# Altium schematic sheet MR9737V2.0.SchDoc
size A3
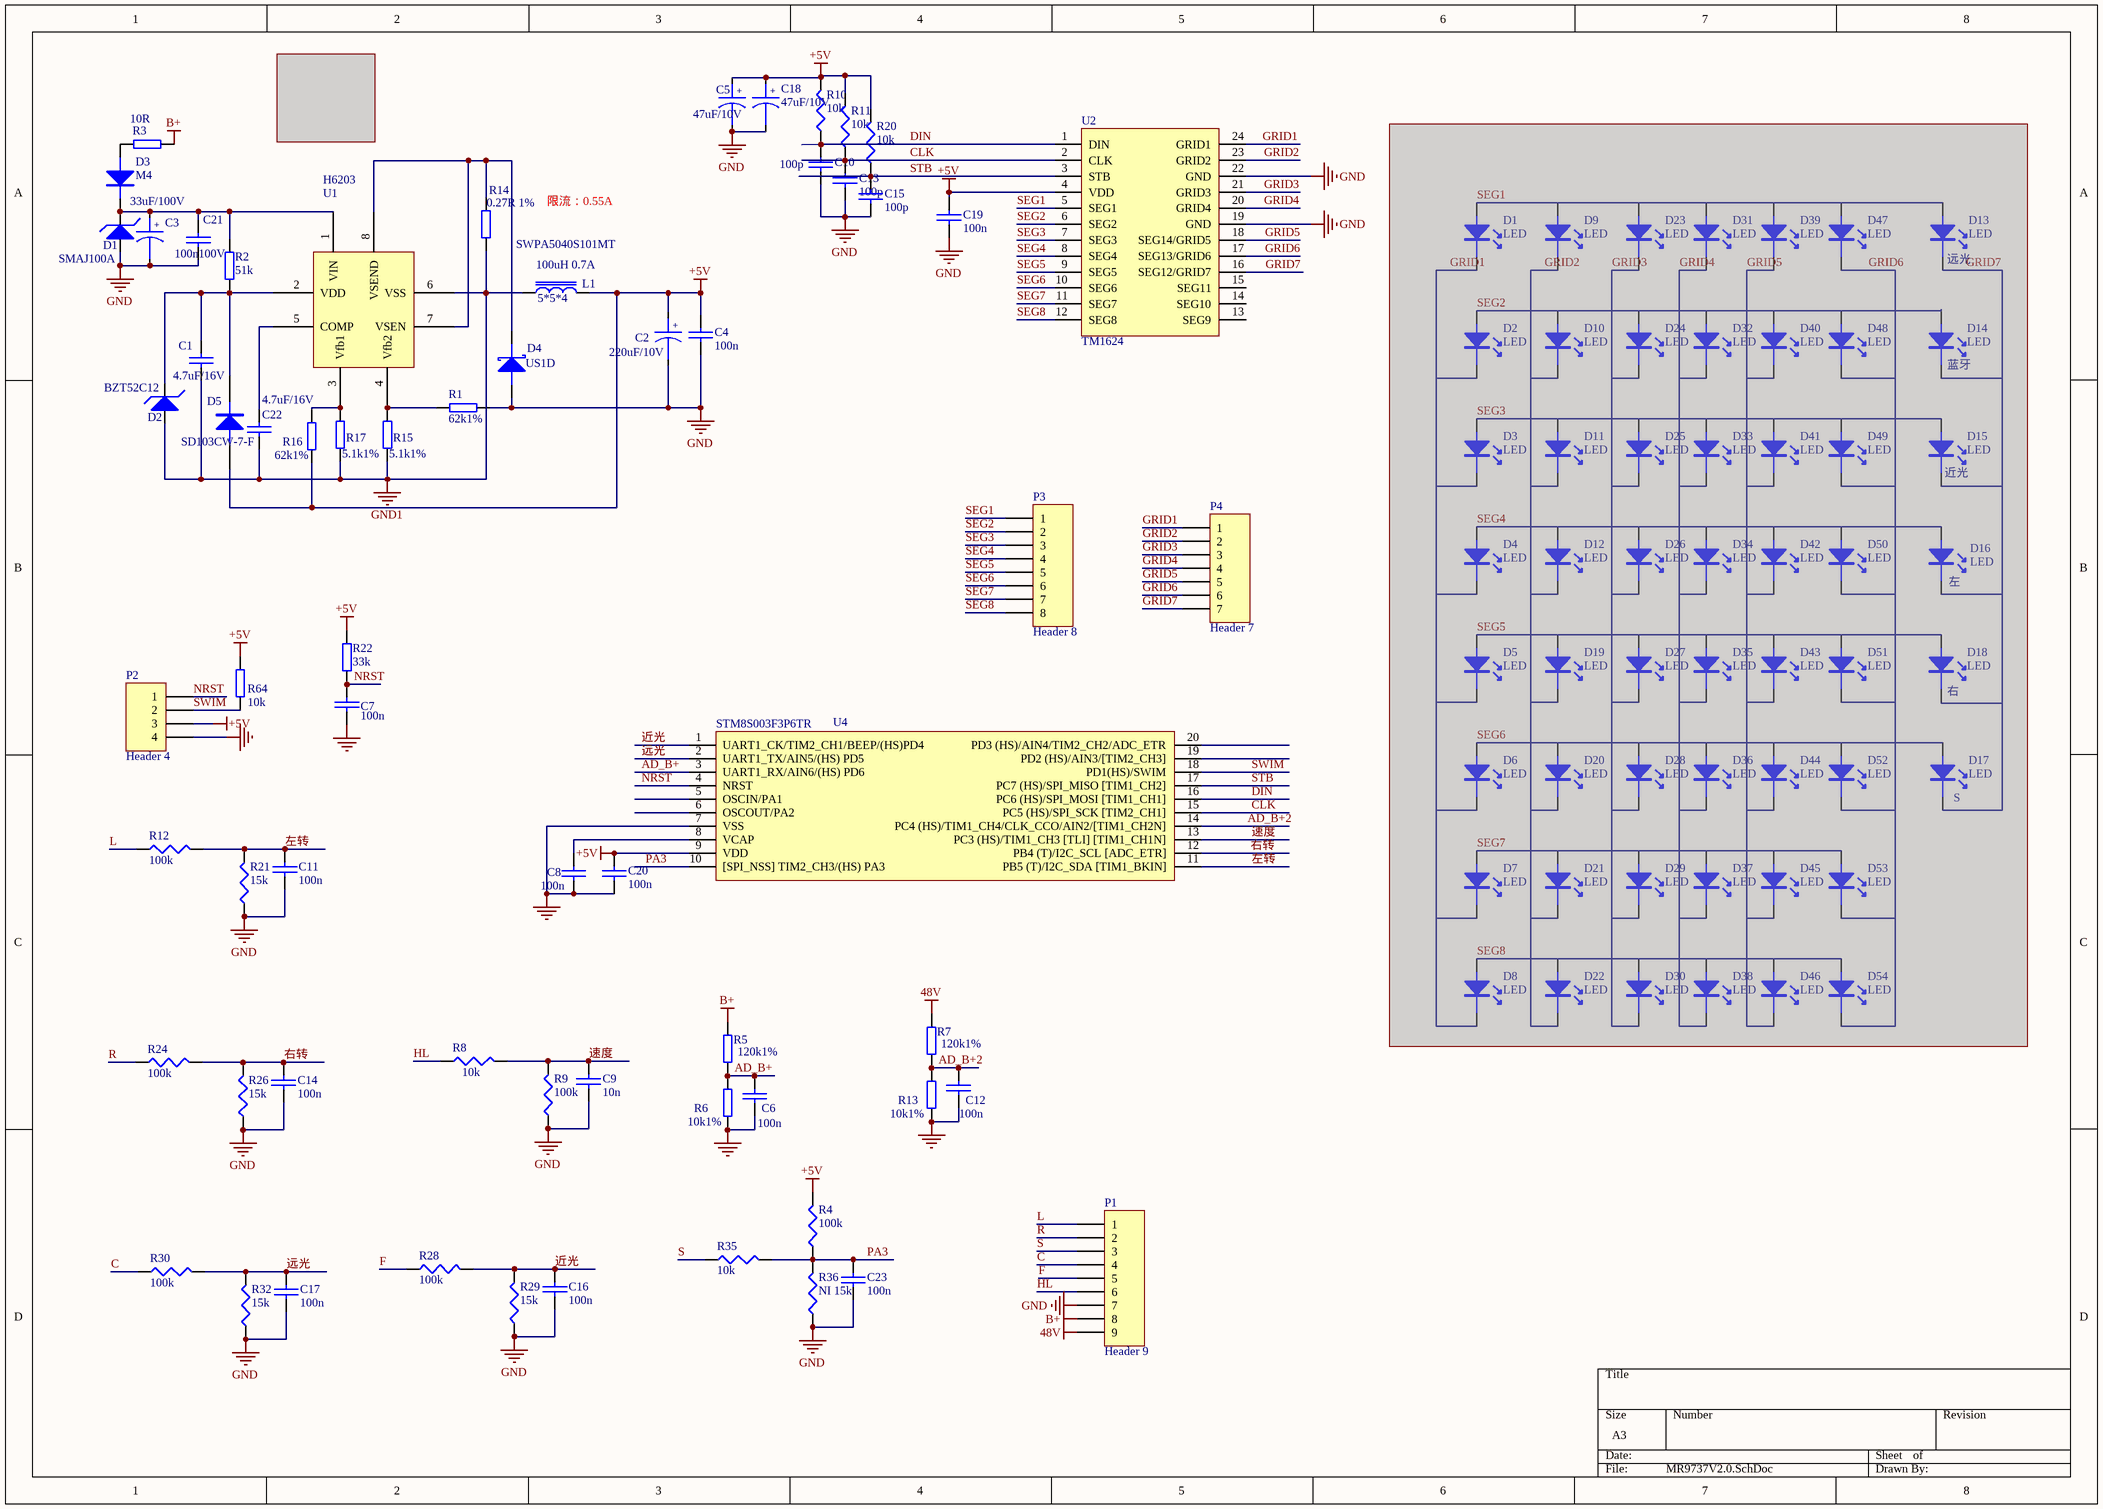
[diagram p0: MR9737V2.0.SchDoc]

## Parts
(Parts that share a designator on the sheet are numbered #1, #2 ... from top to bottom, then left to right.)
C1  4.7uF/16V  [1206]
C2  220uF/10V  [RB.1/.2]
C3  33uF/100V  [RB 8*12]
C4  100n  [0603]
C5  47uF/10V  [CE-D5.2]
C6  100n  [0603]
C7  100n  [0603]
C8  100n  [0603]
C9  10n  [0603]
C10  100p  [0805]
C11  100n  [0603]
C12  100n  [0603]
C13  100p  [0805]
C14  100n  [0603]
C15  100p  [0805]
C16  100n  [0603]
C17  100n  [0603]
C18  47uF/10V  [CE-D5.2]
C19  100n  [0603]
C20  100n  [0603]
C21  100n100V  [0805]
C22  4.7uF/16V  [0805]
C23  100n  [0603]
D1#1  LED  [0603 - 0805]  (masked out: inside a compile mask, not in the netlist)
D1#2  SMAJ100A  [SMA]
D2#1  LED  [0603 - 0805]  (masked out: inside a compile mask, not in the netlist)
D2#2  BZT52C12  [SOD123]
D3#1  M4  [SMA]
D3#2  LED  [0603 - 0805]  (masked out: inside a compile mask, not in the netlist)
D4#1  US1D  [SMA]
D4#2  LED  [0603 - 0805]  (masked out: inside a compile mask, not in the netlist)
D5#1  SD103CW-7-F  [SOD123]
D5#2  LED  [0603 - 0805]  (masked out: inside a compile mask, not in the netlist)
D6  LED  [0603 - 0805]  (masked out: inside a compile mask, not in the netlist)
D7  LED  [0603 - 0805]  (masked out: inside a compile mask, not in the netlist)
D8  LED  [0603 - 0805]  (masked out: inside a compile mask, not in the netlist)
D9  LED  [0603 - 0805]  (masked out: inside a compile mask, not in the netlist)
D10  LED  [0603 - 0805]  (masked out: inside a compile mask, not in the netlist)
D11  LED  [0603 - 0805]  (masked out: inside a compile mask, not in the netlist)
D12  LED  [0603 - 0805]  (masked out: inside a compile mask, not in the netlist)
D13  LED  [0603 - 0805]  (masked out: inside a compile mask, not in the netlist)
D14  LED  [0603 - 0805]  (masked out: inside a compile mask, not in the netlist)
D15  LED  [0603 - 0805]  (masked out: inside a compile mask, not in the netlist)
D16  LED  [0603 - 0805]  (masked out: inside a compile mask, not in the netlist)
D17  LED  [0603 - 0805]  (masked out: inside a compile mask, not in the netlist)
D18  LED  [0603 - 0805]  (masked out: inside a compile mask, not in the netlist)
D19  LED  [0603 - 0805]  (masked out: inside a compile mask, not in the netlist)
D20  LED  [0603 - 0805]  (masked out: inside a compile mask, not in the netlist)
D21  LED  [0603 - 0805]  (masked out: inside a compile mask, not in the netlist)
D22  LED  [0603 - 0805]  (masked out: inside a compile mask, not in the netlist)
D23  LED  [0603 - 0805]  (masked out: inside a compile mask, not in the netlist)
D24  LED  [0603 - 0805]  (masked out: inside a compile mask, not in the netlist)
D25  LED  [0603 - 0805]  (masked out: inside a compile mask, not in the netlist)
D26  LED  [0603 - 0805]  (masked out: inside a compile mask, not in the netlist)
D27  LED  [0603 - 0805]  (masked out: inside a compile mask, not in the netlist)
D28  LED  [0603 - 0805]  (masked out: inside a compile mask, not in the netlist)
D29  LED  [0603 - 0805]  (masked out: inside a compile mask, not in the netlist)
D30  LED  [0603 - 0805]  (masked out: inside a compile mask, not in the netlist)
D31  LED  [0603 - 0805]  (masked out: inside a compile mask, not in the netlist)
D32  LED  [0603 - 0805]  (masked out: inside a compile mask, not in the netlist)
D33  LED  [0603 - 0805]  (masked out: inside a compile mask, not in the netlist)
D34  LED  [0603 - 0805]  (masked out: inside a compile mask, not in the netlist)
D35  LED  [0603 - 0805]  (masked out: inside a compile mask, not in the netlist)
D36  LED  [0603 - 0805]  (masked out: inside a compile mask, not in the netlist)
D37  LED  [0603 - 0805]  (masked out: inside a compile mask, not in the netlist)
D38  LED  [0603 - 0805]  (masked out: inside a compile mask, not in the netlist)
D39  LED  [0603 - 0805]  (masked out: inside a compile mask, not in the netlist)
D40  LED  [0603 - 0805]  (masked out: inside a compile mask, not in the netlist)
D41  LED  [0603 - 0805]  (masked out: inside a compile mask, not in the netlist)
D42  LED  [0603 - 0805]  (masked out: inside a compile mask, not in the netlist)
D43  LED  [0603 - 0805]  (masked out: inside a compile mask, not in the netlist)
D44  LED  [0603 - 0805]  (masked out: inside a compile mask, not in the netlist)
D45  LED  [0603 - 0805]  (masked out: inside a compile mask, not in the netlist)
D46  LED  [0603 - 0805]  (masked out: inside a compile mask, not in the netlist)
D47  LED  [0603 - 0805]  (masked out: inside a compile mask, not in the netlist)
D48  LED  [0603 - 0805]  (masked out: inside a compile mask, not in the netlist)
D49  LED  [0603 - 0805]  (masked out: inside a compile mask, not in the netlist)
D50  LED  [0603 - 0805]  (masked out: inside a compile mask, not in the netlist)
D51  LED  [0603 - 0805]  (masked out: inside a compile mask, not in the netlist)
D52  LED  [0603 - 0805]  (masked out: inside a compile mask, not in the netlist)
D53  LED  [0603 - 0805]  (masked out: inside a compile mask, not in the netlist)
D54  LED  [0603 - 0805]  (masked out: inside a compile mask, not in the netlist)
L1  SWPA5040S101MT  dimension: 5*5*4  [L5040]
P1  Header 9  [SIP9]
P2  Header 4  [HDR1X4]
P3  Header 8  [HDR1X8]
P4  Header 7  [HDR1X7]
R1  62k1%  [0805]
R2  51k  [0805]
R3  10R  [0805]
R4  100k  [0805]
R5  120k1%  [0805]
R6  10k1%  [0805]
R7  120k1%  [0805]
R8  10k  [0805]
R9  100k  [0805]
R10  10k  [0805]
R11  10k  [0805]
R12  100k  [0805]
R13  10k1%  [0805]
R14  0.27R 1%  [0805]
R15  5.1k1%  [0805]
R16  62k1%  [0805]
R17  5.1k1%  [0805]
R20  10k  [0805]
R21  15k  [0805]
R22  33k  [0805]
R24  100k  [0805]
R26  15k  [0805]
R28  100k  [0805]
R29  15k  [0805]
R30  100k  [0805]
R32  15k  [0805]
R35  10k  [0805]
R36  NI 15k  [0805]
R64  10k  [0603]
U1  H6203  [SO-8]
U2  TM1624  [SOP24]
U4  STM8S003F3P6TR  [SSOP20]

## Nets
48V: P1.9 R7.2
+5V: C2.1 C4.2 C5.1 C18.1 C19.2 C20.2 D5#1.1(A) L1.2 P2.3 R4.2 R10.2 R11.2 R16.2 R20.2 R22.2 R64.1 U2.4(VDD) U4.9(VDD)
B+: P1.8 R3.1 R5.2
GND: C2.2 C3.2 C4.1 C5.2 C6.2 C7.1 C8.2 C9.2 C10.1 C11.2 C12.2 C13.1 C14.2 C15.1 C16.2 C17.2 C18.2 C19.1 C20.1 C21.1 C23.2 D1#2.1 D4#1.1(A) P1.7 P2.4 R1.1 R6.2 R9.1 R13.2 R21.1 R26.1 R29.1 R32.1 R36.1 U2.19(GND) U2.22(GND) U4.7(VSS)
GND1: C1.1 C22.1 D2#2.1 L1.1 R14.1 R15.1 R17.1 U1.6(VSS)
AD_B+: C6.1 R5.1 R6.1 U4.3(UART1_RX/AIN6/(HS)_PD6)
AD_B+2: C12.1 R7.1 R13.1 U4.14(PC4_(HS)/TIM1_CH4/CLK_CCO/AIN2/[TIM1_CH2N])
C: P1.4 R30.1
CLK: C13.2 R11.1 U2.2(CLK) U4.15(PC5_(HS)/SPI_SCK_[TIM2_CH1])
DIN: C10.2 R10.1 U2.1(DIN) U4.16(PC6_(HS)/SPI_MOSI_[TIM1_CH1])
F: P1.5 R28.1
GRID1: P4.1 U2.24(GRID1)
GRID2: P4.2 U2.23(GRID2)
GRID3: P4.3 U2.21(GRID3)
GRID4: P4.4 U2.20(GRID4)
GRID5: P4.5 U2.18(SEG14/GRID5)
GRID6: P4.6 U2.17(SEG13/GRID6)
GRID7: P4.7 U2.16(SEG12/GRID7)
HL: P1.6 R8.1
L: P1.1 R12.1
NRST: C7.2 P2.1 R22.1 U4.4(NRST)
PA3: C23.1 R4.1 R35.2 R36.2 U4.10([SPI_NSS]_TIM2_CH3/(HS)_PA3)
R: P1.2 R24.1
S: P1.3 R35.1
SEG1: P3.1 U2.5(SEG1)
SEG2: P3.2 U2.6(SEG2)
SEG3: P3.3 U2.7(SEG3)
SEG4: P3.4 U2.8(SEG4)
SEG5: P3.5 U2.9(SEG5)
SEG6: P3.6 U2.10(SEG6)
SEG7: P3.7 U2.11(SEG7)
SEG8: P3.8 U2.12(SEG8)
STB: C15.2 R20.1 U2.3(STB) U4.17(PC7_(HS)/SPI_MISO_[TIM1_CH2])
SWIM: P2.2 R64.2 U4.18(PD1(HS)/SWIM)
右转: C14.1 R24.2 R26.2 U4.12(PB4_(T)/I2C_SCL_[ADC_ETR])
左转: C11.1 R12.2 R21.2 U4.11(PB5_(T)/I2C_SDA_[TIM1_BKIN])
近光: C16.1 R28.2 R29.2 U4.1(UART1_CK/TIM2_CH1/BEEP/(HS)PD4)
远光: C17.1 R30.2 R32.2 U4.2(UART1_TX/AIN5/(HS)_PD5)
速度: C9.1 R8.2 R9.2 U4.13(PC3_(HS)/TIM1_CH3_[TLI]_[TIM1_CH1N])
NetC1_2: C1.2 D2#2.2 D5#1.2(K) R2.1 U1.2(VDD)
NetC3_1: C3.1 C21.2 D1#2.2 D3#1.2(K) R2.2 U1.1(VIN)
NetC8_1: C8.1 U4.8(VCAP)
NetC22_2: C22.2 U1.5(COMP)
NetD3#1_1: D3#1.1(A) R3.2
NetD4#1_2: D4#1.2(K) R14.2 U1.7(VSEN) U1.8(VSEND)
NetR1_2: R1.2 R15.2 U1.4(Vfb2)
NetR16_1: R16.1 R17.2 U1.3(Vfb1)

Not connected (* = marked no-connect by the designer): U2 13(SEG9) 14(SEG10) 15(SEG11); U4 5(OSCIN/PA1) 6(OSCOUT/PA2) 19(PD2_(HS)/AIN3/[TIM2_CH3]) 20(PD3_(HS)/AIN4/TIM2_CH2/ADC_ETR)

## Notes on the sheet
- 限流：0.55A
- (near D13) 远光
- (near D14) 蓝牙
- (near D15) 近光
- (near D16) 左
- (near D18) 右
- (near D17) S
- (in symbol Capacitor) +
- (in symbol WHLL) 100uH 0.7A

## Library data of the parts
C1 C4 C7 C9-C11 C13-C17 C19-C23 = Cap
C2 C3 C5 C18 = Capacitor
C6 C8 C12 = CAP: Capacitor
D1#2 D2#2 = WDIODE_Z: Diode
D3#1 D5#1 = DIODE
D4#1 = DIODE SCHOTTKY: Schottky Diode
L1 = WHLL
P1 = Header 9: Header, 9-Pin; LatestRevisionDate: 17-Jul-2002; LatestRevisionNote: Re-released for DXP Platform.; Publisher: Altium Limited
P2 = Header 4: Header, 4-Pin; LatestRevisionDate: 17-Jul-2002; LatestRevisionNote: Re-released for DXP Platform.; Publisher: Altium Limited
P3 = Header 8: Header, 8-Pin; LatestRevisionDate: 17-Jul-2002; LatestRevisionNote: Re-released for DXP Platform.; Publisher: Altium Limited
P4 = Header 7: Header, 7-Pin; LatestRevisionDate: 17-Jul-2002; LatestRevisionNote: Re-released for DXP Platform.; Publisher: Altium Limited
R1 R2 R14-R17 R22 = WHLRES: Power: 125mW
R3 R5-R7 R13 R64 = WHLRES
R4 R8-R12 R20 R21 R24 R26 R28-R30 R32 R35 R36 = RES1
U4 = STM8S003F3P6